# Altium schematic sheet MagneticFieldDetection.SchDoc
size A
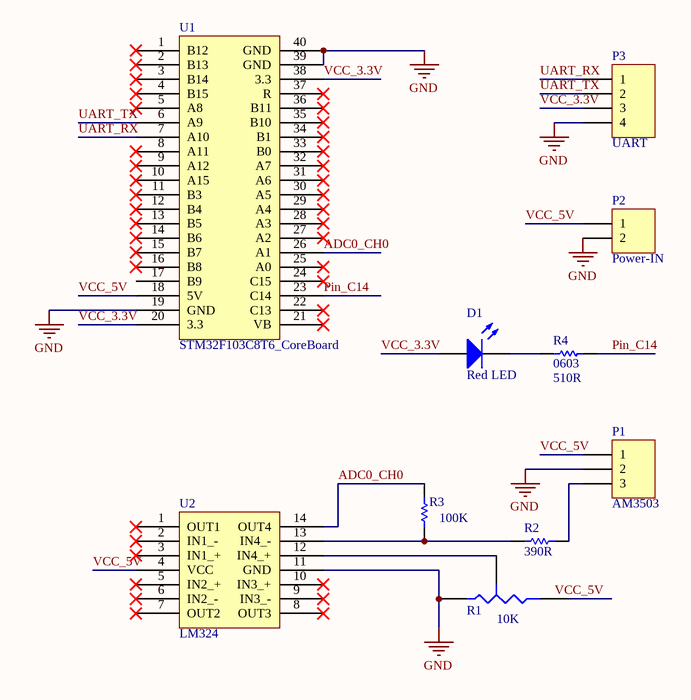
[diagram p0: MagneticFieldDetection.SchDoc]

## Parts
D1  Red LED  [LED-0]
P1  AM3503  [HDR1X3]
P2  Power-IN  [HDR1X2]
P3  UART  [HDR1X4H]
R1  value 10K  [VR3]  (hidden comment: Res Tap)
R2  value 390R  [AXIAL-0.5]  (hidden comment: Res Semi)
R3  value 100K  [AXIAL-0.5]  (hidden comment: Res Semi)
R4  0603  value 510R  [AXIAL-0.3]
U1  STM32F103C8T6_CoreBoard
U2  LM324  [LM324]

## Nets
GND: P1.2 P2.2 P3.4 R1.1(A) U1.19(GND) U1.39(GND) U1.40(GND) U2.11(GND)
ADC0_CH0: R3.2 U1.26(A1) U2.14(OUT4)
Pin_C14: R4.2 U1.23(C14)
UART_RX: P3.1 U1.7(A10)
UART_TX: P3.2 U1.6(A9)
VCC_3.3V: D1.1(A) P3.3 U1.20(3.3) U1.38(3.3)
VCC_5V: P1.1 P2.1 U1.18(5V) U2.4(VCC)
NetD1_2: D1.2(K) R4.1
NetP1_3: P1.3 R2.1
NetR1_3: R1.3(TAP) U2.12(IN4_+)
NetR2_2: R2.2 R3.1 U2.13(IN4_-)

Not connected (* = marked no-connect by the designer): R1 2(B); U1 1(B12)* 2(B13)* 3(B14)* 4(B15)* 5(A8)* 8(A11)* 9(A12)* 10(A15)* 11(B3)* 12(B4)* 13(B5)* 14(B6)* 15(B7)* 16(B8)* 17(B9) 21(VB)* 22(C13)* 24(C15)* 25(A0)* 27(A2)* 28(A3)* 29(A4)* 30(A5)* 31(A6)* 32(A7)* 33(B0)* 34(B1)* 35(B10)* 36(B11)* 37(R)*; U2 1(OUT1)* 2(IN1_-)* 3(IN1_+)* 5(IN2_+)* 6(IN2_-)* 7(OUT2)* 8(OUT3)* 9(IN3_-)* 10(IN3_+)*

## Notes on the sheet
- Labels drawn without touching a wire or pin: VCC_5V

## Library data of the parts
D1 = LED0: Typical INFRARED GaAs LED; Published: 8-Jun-2000; LatestRevisionDate: 08-Jul-2005; LatestRevisionNote: Mech Layer 1 removed.; PackageReference: LED-0; Publisher: Altium Limited; PackageDescription: LED; 2 Leads
P1 = Header 3: Header, 3-Pin; LatestRevisionDate: 17-Jul-2002; LatestRevisionNote: Re-released for DXP Platform.; Publisher: Altium Limited
P2 = Header 2: Header, 2-Pin; LatestRevisionDate: 17-Jul-2002; LatestRevisionNote: Re-released for DXP Platform.; Publisher: Altium Limited
P3 = Header 4H: Header, 4-Pin, Right Angle; LatestRevisionDate: 17-Jul-2002; LatestRevisionNote: Re-released for DXP Platform.; Publisher: Altium Limited
R1 = Res Tap: Tapped Resistor; Sim Note: Enter the Resistance value and the set point into parameter fields.; Set Position: 0.5; Published: 24-Mar-1999; LatestRevisionDate: 17-Jul-2002; LatestRevisionNote: Re-released for DXP Platform.; PackageReference: VR3; Publisher: Altium Limited; PackageDescription: Variable Resistor, Thru-Hole; 3 Leads
R2 R3 = Res Semi: Semiconductor Resistor; Published: 8-Jun-2000; LatestRevisionDate: 17-Jul-2002; LatestRevisionNote: Re-released for DXP Platform.; PackageReference: AXIAL-0.5; Publisher: Altium Limited; PackageDescription: Axial Device, Thru-Hole; 2 Leads; 0.5 in Pin Spacing
R4 = Res1: Resistor; Published: 8-Jun-2000; LatestRevisionDate: 17-Jul-2002; LatestRevisionNote: Re-released for DXP Platform.; PackageReference: AXIAL-0.3; Publisher: Altium Limited; PackageDescription: Axial Device, Thru-Hole; 2 Leads; 0.3 in Pin Spacing